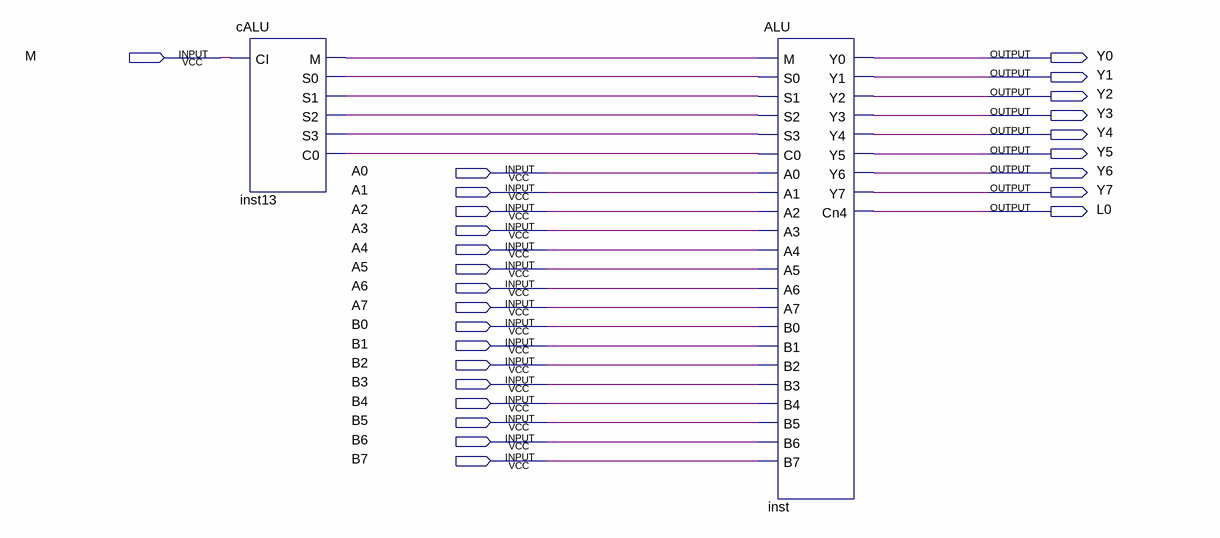
[diagram p0: schematic sheet]
// Quartus schematic tAlu.bdf as structural Verilog: 2 symbols, 26 pins
module tAlu (
  input  M,
  input  A0,
  input  A1,
  input  A2,
  input  A3,
  input  A4,
  input  A5,
  input  A6,
  input  A7,
  input  B0,
  input  B1,
  input  B2,
  input  B3,
  input  B4,
  input  B5,
  input  B6,
  input  B7,
  output Y0,
  output Y1,
  output Y2,
  output Y3,
  output Y4,
  output Y5,
  output Y6,
  output Y7,
  output L0
);

  wire inst13_c0, inst13_m, inst13_s0, inst13_s1, inst13_s2, inst13_s3;

  cALU inst13 (.CI(M), .M(inst13_m), .S0(inst13_s0), .S1(inst13_s1), .S2(inst13_s2), .S3(inst13_s3), .C0(inst13_c0));
  ALU inst (
    .M(inst13_m), .S0(inst13_s0), .S1(inst13_s1), .S2(inst13_s2), .S3(inst13_s3), .C0(inst13_c0), .A0(A0),
    .A1(A1), .A2(A2), .A3(A3), .A4(A4), .A5(A5), .A6(A6), .A7(A7), .B0(B0), .B1(B1), .B2(B2), .B3(B3),
    .B4(B4), .B5(B5), .B6(B6), .B7(B7), .Y0(Y0), .Y1(Y1), .Y2(Y2), .Y3(Y3), .Y4(Y4), .Y5(Y5), .Y6(Y6),
    .Y7(Y7), .Cn4(L0));
endmodule
